# Altium schematic sheet Microcontroller.SchDoc
size D
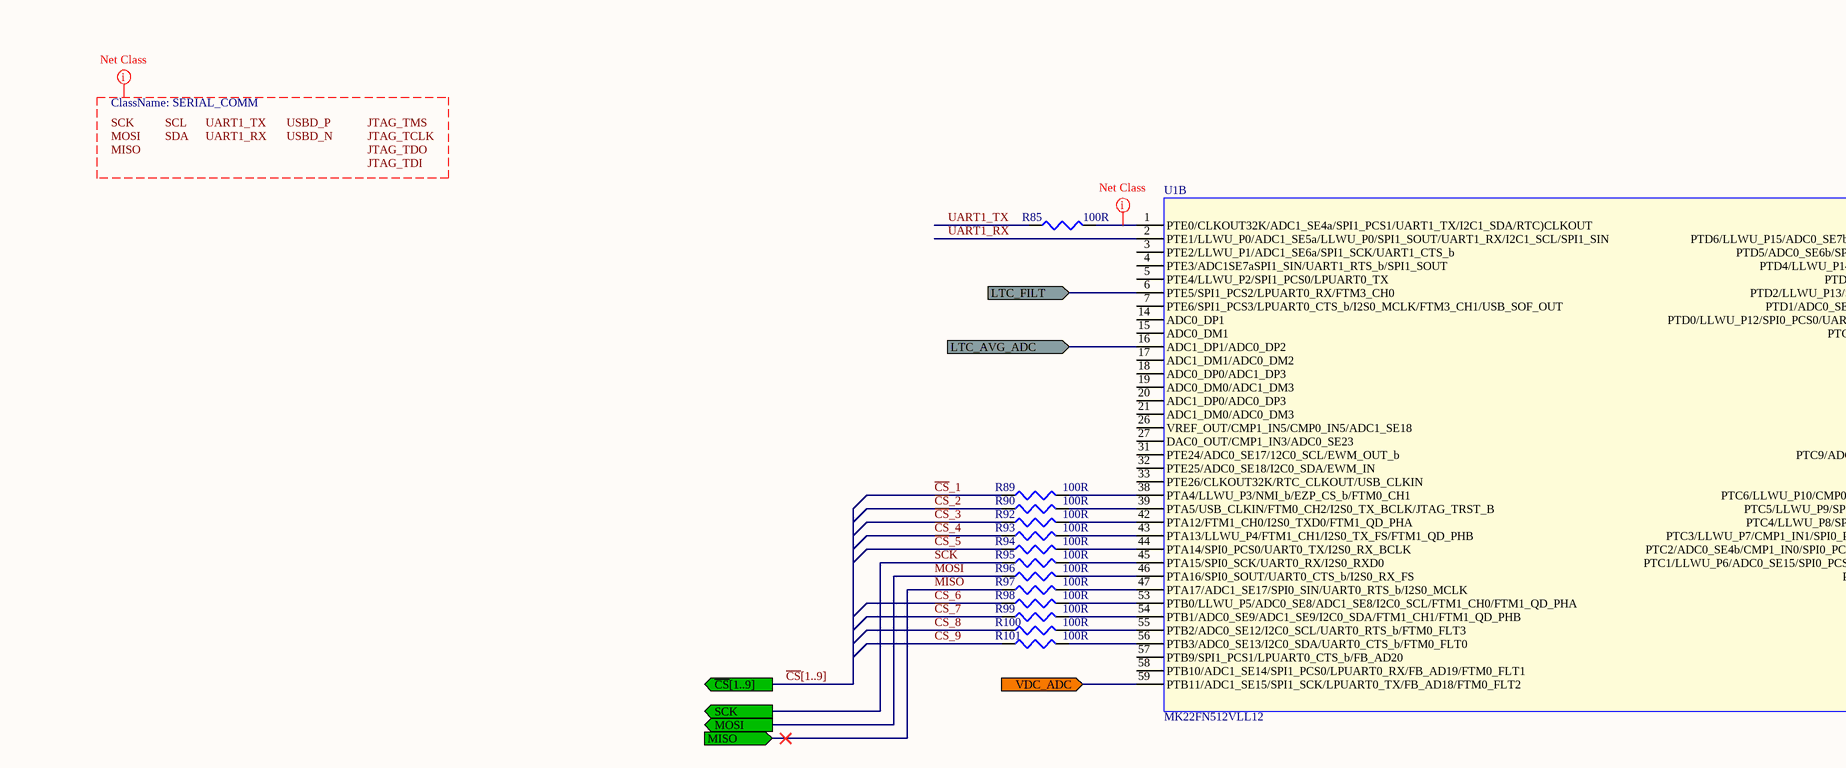
[diagram p0: Microcontroller.SchDoc, top left]
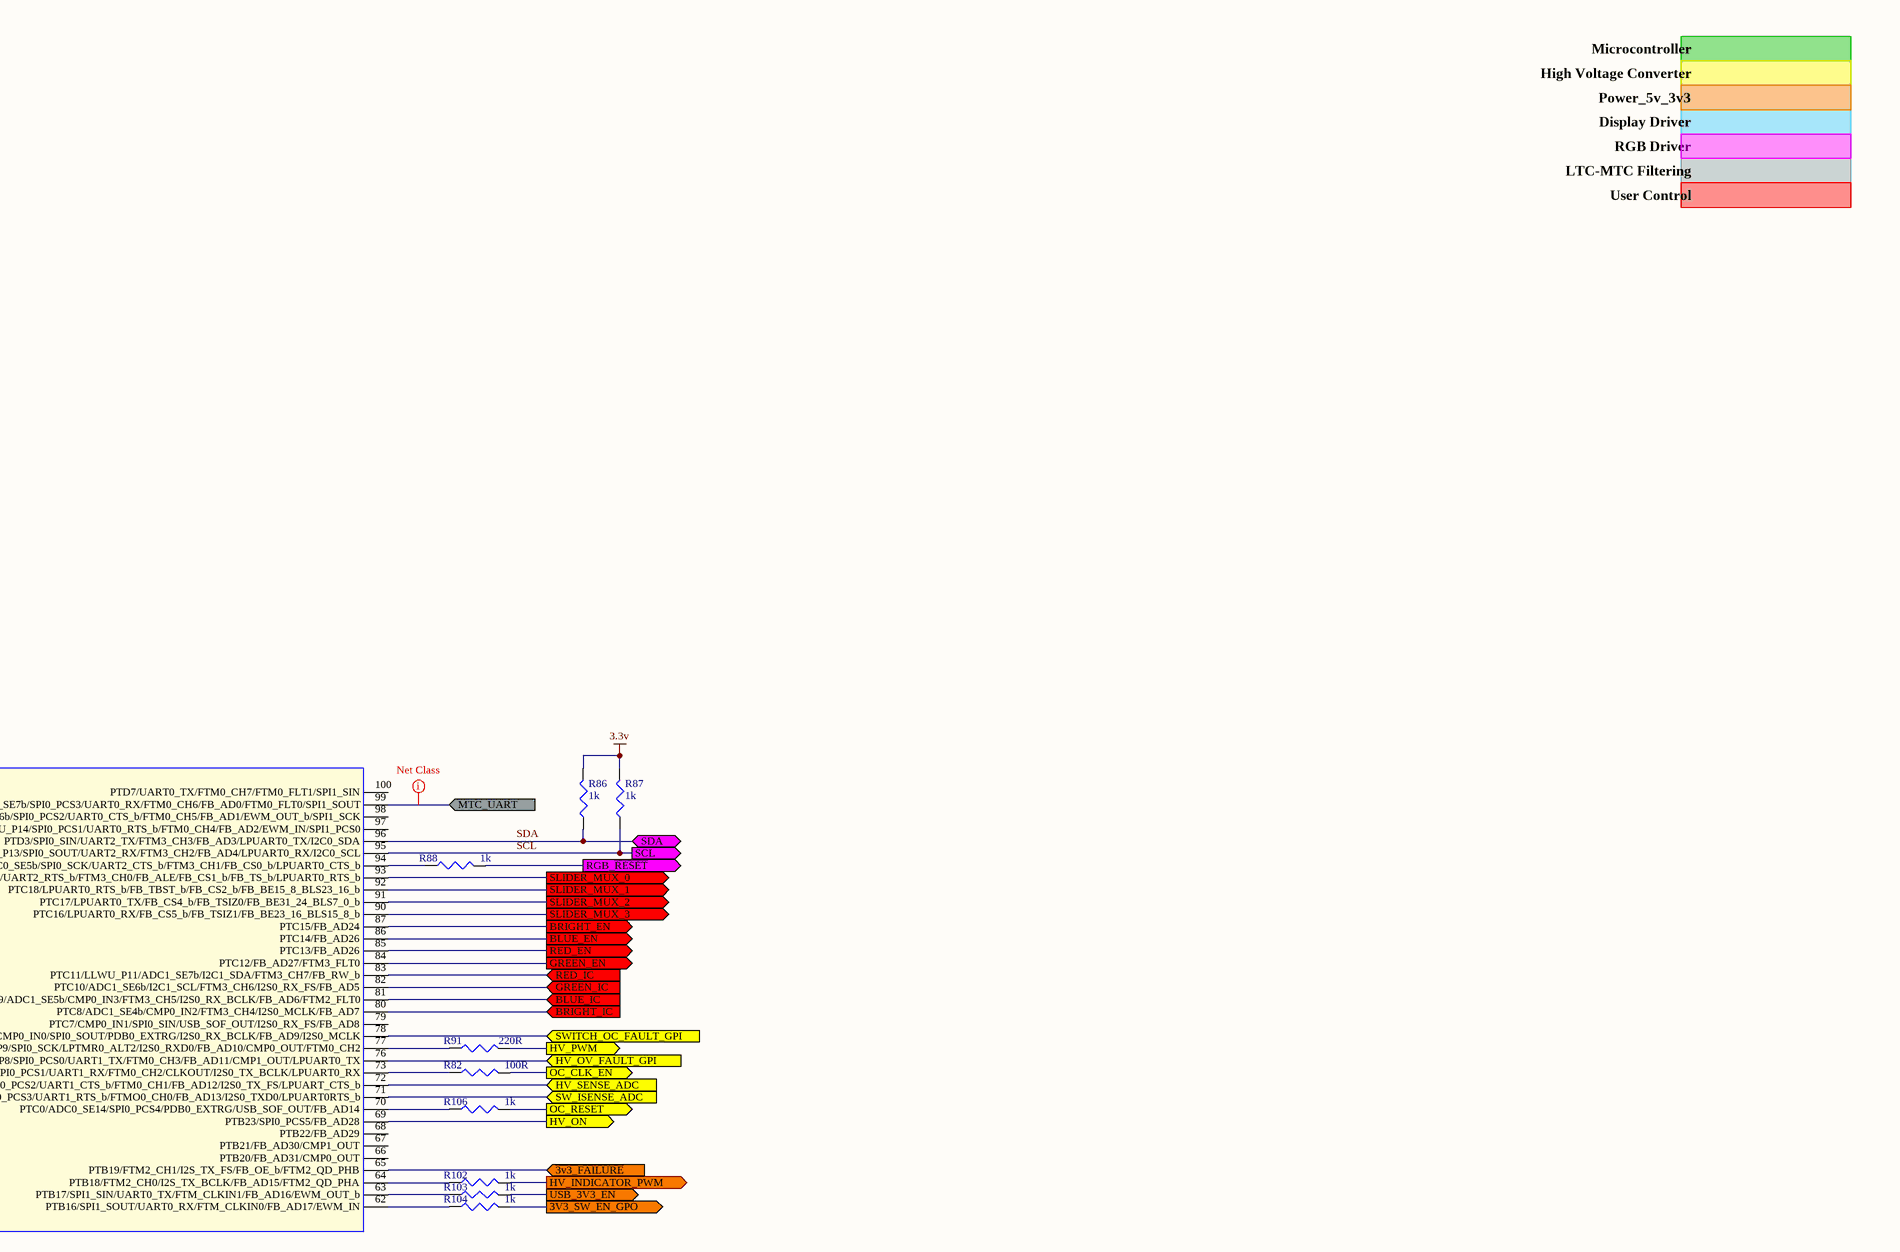
[diagram p1: Microcontroller.SchDoc, top right]
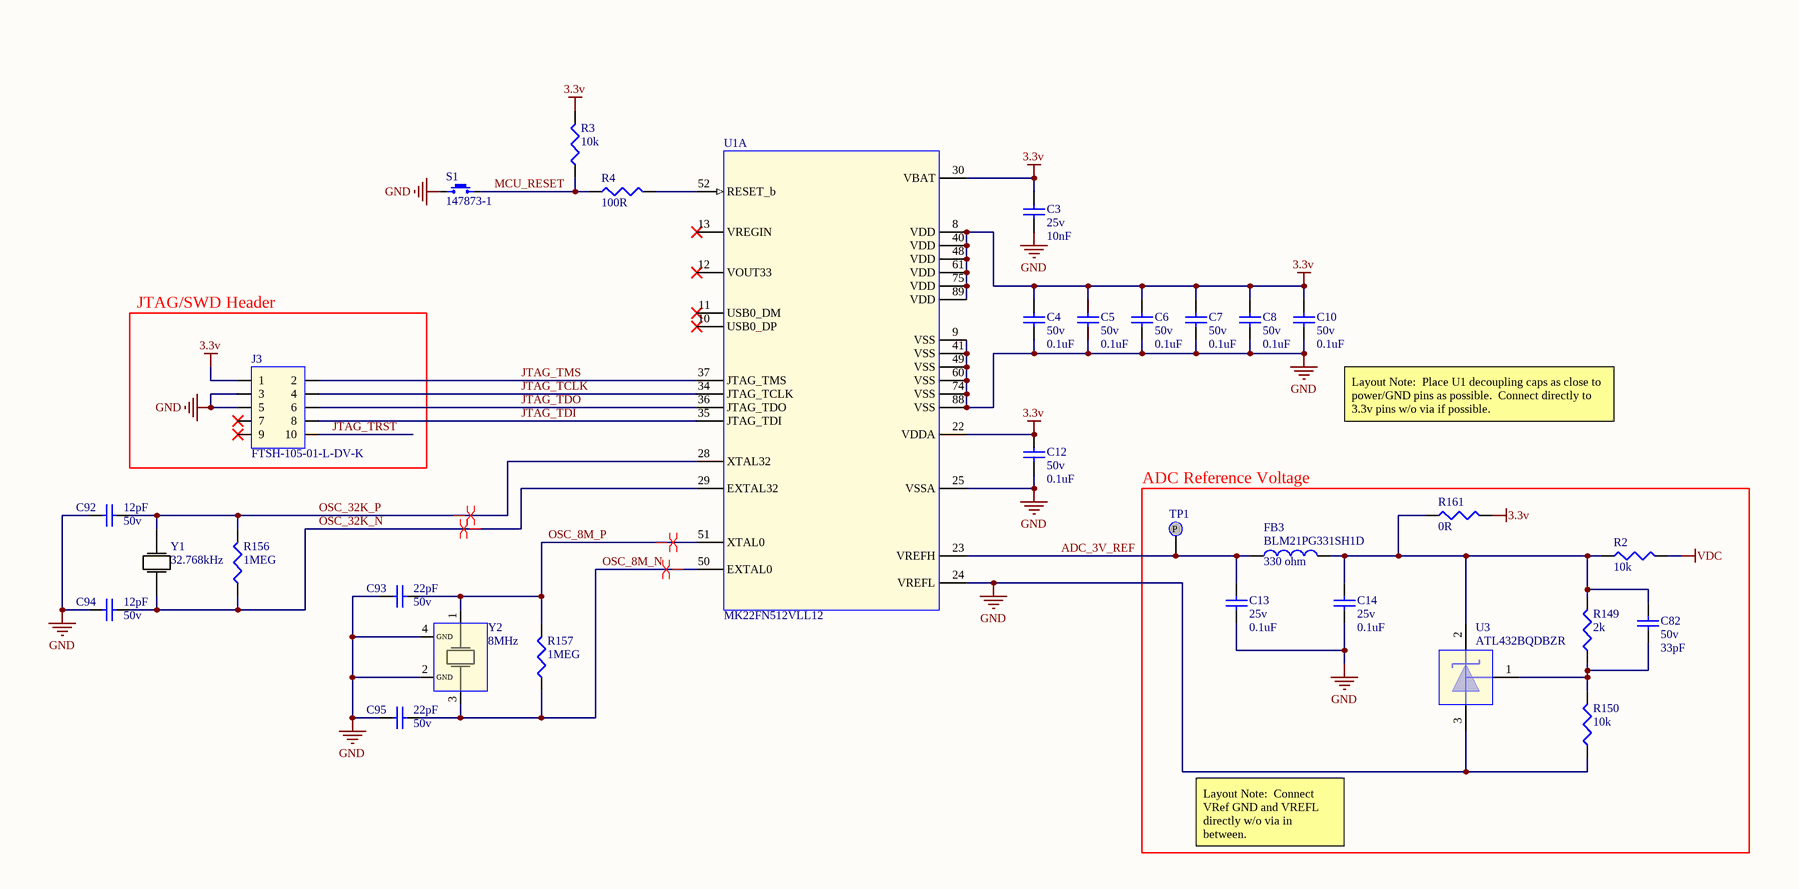
[diagram p2: Microcontroller.SchDoc, bottom left]
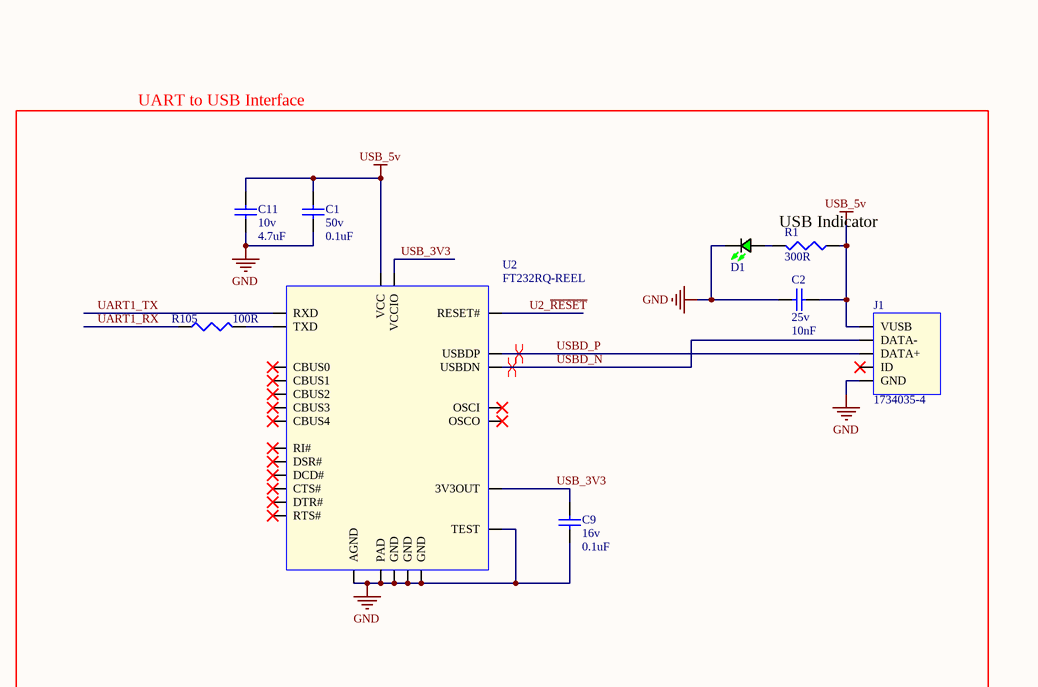
[diagram p3: Microcontroller.SchDoc, bottom right]

## Parts
C1  Voltage: 50v  [CAP0603R]  (hidden comment: 0.1uF)
C2  Voltage: 25v  [CAP0402R]  (hidden comment: 10nF)
C3  Voltage: 25v  [CAP0402R]  (hidden comment: 10nF)
C4  Voltage: 50v  [CAP0603R]  (hidden comment: 0.1uF)
C5  Voltage: 50v  [CAP0603R]  (hidden comment: 0.1uF)
C6  Voltage: 50v  [CAP0603R]  (hidden comment: 0.1uF)
C7  Voltage: 50v  [CAP0603R]  (hidden comment: 0.1uF)
C8  Voltage: 50v  [CAP0603R]  (hidden comment: 0.1uF)
C9  Voltage: 16v  [CAP0603R]  (hidden comment: 0.1uF)
C10  Voltage: 50v  [CAP0603R]  (hidden comment: 0.1uF)
C11  Voltage: 10v  [CAP0805R]  (hidden comment: 4.7uF)
C12  Voltage: 50v  [CAP0603R]  (hidden comment: 0.1uF)
C13  Voltage: 25v  [CAP0603R]  (hidden comment: 0.1uF)
C14  Voltage: 25v  [CAP0603R]  (hidden comment: 0.1uF)
C82  Voltage: 50v  [CAP0402R]  (hidden comment: 33pF)
C92  Voltage: 50v  [CAP0402R]  (hidden comment: 12pF)
C93  Voltage: 50v  [CAP0402R]  (hidden comment: 22pF)
C94  Voltage: 50v  [CAP0402R]  (hidden comment: 12pF)
C95  Voltage: 50v  [CAP0402R]  (hidden comment: 22pF)
D1  LTST-S270KGKT  [LED Green 0603]  (value not drawn)
FB3  BLM21PG331SH1D  IMPEDANCE: 330 ohm  [RES0805R]
J1  1734035-4  [USB MINI-B 1734035-4]
J3  FTSH-105-01-L-DV-K  [2x5 JTAG Header]
R1  300R  [RES0402R]
R2  10k  [RES0402R]
R3  10k  [RES0402R]
R4  100R  [RES0402R]
R82  100R  [RES0402R]
R85  100R  [RES0402R]
R86  1k  [RES0402R]
R87  1k  [RES0402R]
R88  1k  [RES0402R]
R89  100R  [RES0402R]
R90  100R  [RES0402R]
R91  220R  [RES0402R]
R92  100R  [RES0402R]
R93  100R  [RES0402R]
R94  100R  [RES0402R]
R95  100R  [RES0402R]
R96  100R  [RES0402R]
R97  100R  [RES0402R]
R98  100R  [RES0402R]
R99  100R  [RES0402R]
R100  100R  [RES0402R]
R101  100R  [RES0402R]
R102  1k  [RES0402R]
R103  1k  [RES0402R]
R104  1k  [RES0402R]
R105  100R  [RES0402R]
R106  1k  [RES0402R]
R149  2k  [RES0402R]
R150  10k  [RES0402R]
R156  1MEG  [RES0402R]
R157  1MEG  [RES0402R]
R161  0R  [RES0402R]
S1  147873-1  [TECONN_14783-1]
TP1  NONE  [TESTPOINT - 1.5mm Round Pad]  (value not drawn)
U1  MK22FN512VLL12  [LQFP100 0.5mm 14mmx14mm]  (parts A,B of 2)
U2  FT232RQ-REEL  [QFN32]
U3  ATL432BQDBZR  [SOT23-3M]
Y1  32.768kHz  [ABS07-32.768KHZ-T]
Y2  8MHz  [ABMM2-8.000MHZ-B2-T]

## Blocks framed on the sheet
JTAG/SWD Header: J3
ADC Reference Voltage: C13 C14 C82 FB3 R2 R149 R150 R161 TP1 U3

## Ports
3V3_SW_EN_GPO (out), BLUE_EN (out), BLUE_IC (in), BRIGHT_EN (out), BRIGHT_IC (in), GREEN_EN (out), GREEN_IC (in), HV_INDICATOR_PWM (out), HV_ON (out), HV_OV_FAULT_GPI (in), HV_PWM (out), HV_SENSE_ADC (in), LTC_AVG_ADC (in), LTC_FILT (in), MISO (in), MOSI (out), MTC_UART (in), OC_CLK_EN (out), OC_RESET (out), RED_EN (out), RED_IC (in), RGB_~{RESET} (out), SCK (out), SCL (out), SDA (bidir), SLIDER_MUX_0 (out), SLIDER_MUX_1 (out), SLIDER_MUX_2 (out), SLIDER_MUX_3 (out), SW_ISENSE_ADC (in), SWITCH_OC_FAULT_GPI (in), USB_3V3_EN (out), VDC_ADC (in), ~{3v3_FAILURE} (in), ~{CS}[1..9] (out)

## Nets
3.3v: C3.2 C4.1 C5.1 C6.1 C7.1 C8.1 C10.1 C12.1 J3.1 R3.2 R86.2 R87.2 R161.2 U1.8(VDD) U1.22(VDDA) U1.30(VBAT) U1.40(VDD) U1.48(VDD) U1.61(VDD) U1.75(VDD) U1.89(VDD)
GND: C1.2 C2.1 C3.1 C4.2 C5.2 C6.2 C7.2 C8.2 C9.1 C10.2 C11.2 C12.2 C13.2 C14.2 C92.2 C93.1 C94.2 C95.1 D1.1(K) J1.5(GND) J1.SH1 J1.SH2 J1.SH3 J1.SH4 J3.3 J3.5 R150.1 S1.1 U1.9(VSS) U1.24(VREFL) U1.25(VSSA) U1.41(VSS) U1.49(VSS) U1.60(VSS) U1.74(VSS) U1.88(VSS) U2.0(PAD) U2.4(GND) U2.17(GND) U2.20(GND) U2.24(AGND) U2.26(TEST) U3.3(A) Y2.2(GND) Y2.4(GND)
USB_5v: C1.1 C2.2 C11.1 J1.1(VUSB) R1.2 U2.19(VCC)
VDC: R2.2
~{3v3_FAILURE}: U1.65(PTB19/FTM2_CH1/I2S_TX_FS/FB_OE_b/FTM2_QD_PHB) ; port ~{3v3_FAILURE}
3V3_SW_EN_GPO: R104.2 ; port 3V3_SW_EN_GPO
ADC_3V_REF: C13.1 FB3.1 TP1.1 U1.23(VREFH)
BLUE_EN: U1.86(PTC14/FB_AD26) ; port BLUE_EN
BLUE_IC: U1.81(PTC9/ADC1_SE5b/CMP0_IN3/FTM3_CH5/I2S0_RX_BCLK/FB_AD6/FTM2_FLT0) ; port BLUE_IC
BRIGHT_EN: U1.87(PTC15/FB_AD24) ; port BRIGHT_EN
BRIGHT_IC: U1.80(PTC8/ADC1_SE4b/CMP0_IN2/FTM3_CH4/I2S0_MCLK/FB_AD7) ; port BRIGHT_IC
~{CS}_1: R89.1
~{CS}_2: R90.1
~{CS}_3: R92.1
~{CS}_4: R93.1
~{CS}_5: R94.1
~{CS}_6: R98.1
~{CS}_7: R99.1
~{CS}_8: R100.1
~{CS}_9: R101.1
GREEN_EN: U1.84(PTC12/FB_AD27/FTM3_FLT0) ; port GREEN_EN
GREEN_IC: U1.82(PTC10/ADC1_SE6b/I2C1_SCL/FTM3_CH6/I2S0_RX_FS/FB_AD5) ; port GREEN_IC
HV_INDICATOR_PWM: R102.2 ; port HV_INDICATOR_PWM
HV_ON: U1.69(PTB23/SPI0_PCS5/FB_AD28) ; port HV_ON
HV_OV_FAULT_GPI: U1.76(PTC4/LLWU_P8/SPI0_PCS0/UART1_TX/FTM0_CH3/FB_AD11/CMP1_OUT/LPUART0_TX) ; port HV_OV_FAULT_GPI
HV_PWM: R91.2 ; port HV_PWM
HV_SENSE_ADC: U1.72(PTC2/ADC0_SE4b/CMP1_IN0/SPI0_PCS2/UART1_CTS_b/FTM0_CH1/FB_AD12/I2S0_TX_FS/LPUART_CTS_b) ; port HV_SENSE_ADC
JTAG_TCLK: J3.4 U1.34(JTAG_TCLK)
JTAG_TDI: J3.8 U1.35(JTAG_TDI)
JTAG_TDO: J3.6 U1.36(JTAG_TDO)
JTAG_TMS: J3.2 U1.37(JTAG_TMS)
JTAG_TRST: J3.10
LTC_AVG_ADC: U1.16(ADC1_DP1/ADC0_DP2) ; port LTC_AVG_ADC
LTC_FILT: U1.6(PTE5/SPI1_PCS2/LPUART0_RX/FTM3_CH0) ; port LTC_FILT
MCU_RESET: R3.1 R4.1 S1.2
MISO: R97.1 ; port MISO
MOSI: R96.1 ; port MOSI
MTC_UART: U1.99(PTD6/LLWU_P15/ADC0_SE7b/SPI0_PCS3/UART0_RX/FTM0_CH6/FB_AD0/FTM0_FLT0/SPI1_SOUT) ; port MTC_UART
OC_CLK_EN: R82.2 ; port OC_CLK_EN
OC_RESET: R106.2 ; port OC_RESET
OSC_8M_N: C95.2 R157.1 U1.50(EXTAL0) Y2.3
OSC_8M_P: C93.2 R157.2 U1.51(XTAL0) Y2.1
OSC_32K_N: C94.1 R156.1 U1.29(EXTAL32) Y1.2
OSC_32K_P: C92.1 R156.2 U1.28(XTAL32) Y1.1
RED_EN: U1.85(PTC13/FB_AD26) ; port RED_EN
RED_IC: U1.83(PTC11/LLWU_P11/ADC1_SE7b/I2C1_SDA/FTM3_CH7/FB_RW_b) ; port RED_IC
RGB_~{RESET}: R88.2 ; port RGB_~{RESET}
SCK: R95.1 ; port SCK
SCL: R87.1 U1.95(PTD2/LLWU_P13/SPI0_SOUT/UART2_RX/FTM3_CH2/FB_AD4/LPUART0_RX/I2C0_SCL) ; port SCL
SDA: R86.1 U1.96(PTD3/SPI0_SIN/UART2_TX/FTM3_CH3/FB_AD3/LPUART0_TX/I2C0_SDA) ; port SDA
SLIDER_MUX_0: U1.93(PTD0/LLWU_P12/SPI0_PCS0/UART2_RTS_b/FTM3_CH0/FB_ALE/FB_CS1_b/FB_TS_b/LPUART0_RTS_b) ; port SLIDER_MUX_0
SLIDER_MUX_1: U1.92(PTC18/LPUART0_RTS_b/FB_TBST_b/FB_CS2_b/FB_BE15_8_BLS23_16_b) ; port SLIDER_MUX_1
SLIDER_MUX_2: U1.91(PTC17/LPUART0_TX/FB_CS4_b/FB_TSIZ0/FB_BE31_24_BLS7_0_b) ; port SLIDER_MUX_2
SLIDER_MUX_3: U1.90(PTC16/LPUART0_RX/FB_CS5_b/FB_TSIZ1/FB_BE23_16_BLS15_8_b) ; port SLIDER_MUX_3
SW_ISENSE_ADC: U1.71(PTC1/LLWU_P6/ADC0_SE15/SPI0_PCS3/UART1_RTS_b/FTMO0_CH0/FB_AD13/I2S0_TXD0/LPUART0RTS_b) ; port SW_ISENSE_ADC
SWITCH_OC_FAULT_GPI: U1.78(PTC6/LLWU_P10/CMP0_IN0/SPI0_SOUT/PDB0_EXTRG/I2S0_RX_BCLK/FB_AD9/I2S0_MCLK) ; port SWITCH_OC_FAULT_GPI
U2_~{RESET}: U2.18(RESET#)
UART1_RX: R105.1 U1.2(PTE1/LLWU_P0/ADC1_SE5a/LLWU_P0/SPI1_SOUT/UART1_RX/I2C1_SCL/SPI1_SIN)
UART1_TX: R85.1 U2.2(RXD)
USB_3V3: C9.2 U2.1(VCCIO) U2.16(3V3OUT)
USB_3V3_EN: R103.2 ; port USB_3V3_EN
USBD_N: J1.2(DATA-) U2.15(USBDN)
USBD_P: J1.3(DATA+) U2.14(USBDP)
VDC_ADC: U1.59(PTB11/ADC1_SE15/SPI1_SCK/LPUART0_TX/FB_AD18/FTM0_FLT2) ; port VDC_ADC
NetC14_1: C14.1 C82.1 FB3.2 R2.1 R149.2 R161.1 U3.2(K)
NetC82_2: C82.2 R149.1 R150.2 U3.1(REF)
NetD1_2: D1.2(A) R1.1
NetR4_2: R4.2 U1.52(RESET_b)
NetR82_1: R82.1 U1.73(PTC3/LLWU_P7/CMP1_IN1/SPI0_PCS1/UART1_RX/FTM0_CH2/CLKOUT/I2S0_TX_BCLK/LPUART0_RX)
NetR85_2: R85.2 U1.1(PTE0/CLKOUT32K/ADC1_SE4a/SPI1_PCS1/UART1_TX/I2C1_SDA/RTC)CLKOUT)
NetR88_1: R88.1 U1.94(PTD1/ADC0_SE5b/SPI0_SCK/UART2_CTS_b/FTM3_CH1/FB_CS0_b/LPUART0_CTS_b)
NetR89_2: R89.2 U1.38(PTA4/LLWU_P3/NMI_b/EZP_CS_b/FTM0_CH1)
NetR90_2: R90.2 U1.39(PTA5/USB_CLKIN/FTM0_CH2/I2S0_TX_BCLK/JTAG_TRST_B)
NetR91_1: R91.1 U1.77(PTC5/LLWU_P9/SPI0_SCK/LPTMR0_ALT2/I2S0_RXD0/FB_AD10/CMP0_OUT/FTM0_CH2)
NetR92_2: R92.2 U1.42(PTA12/FTM1_CH0/I2S0_TXD0/FTM1_QD_PHA)
NetR93_2: R93.2 U1.43(PTA13/LLWU_P4/FTM1_CH1/I2S0_TX_FS/FTM1_QD_PHB)
NetR94_2: R94.2 U1.44(PTA14/SPI0_PCS0/UART0_TX/I2S0_RX_BCLK)
NetR95_2: R95.2 U1.45(PTA15/SPI0_SCK/UART0_RX/I2S0_RXD0)
NetR96_2: R96.2 U1.46(PTA16/SPI0_SOUT/UART0_CTS_b/I2S0_RX_FS)
NetR97_2: R97.2 U1.47(PTA17/ADC1_SE17/SPI0_SIN/UART0_RTS_b/I2S0_MCLK)
NetR98_2: R98.2 U1.53(PTB0/LLWU_P5/ADC0_SE8/ADC1_SE8/I2C0_SCL/FTM1_CH0/FTM1_QD_PHA)
NetR99_2: R99.2 U1.54(PTB1/ADC0_SE9/ADC1_SE9/I2C0_SDA/FTM1_CH1/FTM1_QD_PHB)
NetR100_2: R100.2 U1.55(PTB2/ADC0_SE12/I2C0_SCL/UART0_RTS_b/FTM0_FLT3)
NetR101_2: R101.2 U1.56(PTB3/ADC0_SE13/I2C0_SDA/UART0_CTS_b/FTM0_FLT0)
NetR102_1: R102.1 U1.64(PTB18/FTM2_CH0/I2S_TX_BCLK/FB_AD15/FTM2_QD_PHA)
NetR103_1: R103.1 U1.63(PTB17/SPI1_SIN/UART0_TX/FTM_CLKIN1/FB_AD16/EWM_OUT_b)
NetR104_1: R104.1 U1.62(PTB16/SPI1_SOUT/UART0_RX/FTM_CLKIN0/FB_AD17/EWM_IN)
NetR105_2: R105.2 U2.30(TXD)
NetR106_1: R106.1 U1.70(PTC0/ADC0_SE14/SPI0_PCS4/PDB0_EXTRG/USB_SOF_OUT/FB_AD14)

Not connected (* = marked no-connect by the designer): J1 4(ID)*; J3 7* 9*; U1 3(PTE2/LLWU_P1/ADC1_SE6a/SPI1_SCK/UART1_CTS_b) 4(PTE3/ADC1SE7aSPI1_SIN/UART1_RTS_b/SPI1_SOUT) 5(PTE4/LLWU_P2/SPI1_PCS0/LPUART0_TX) 7(PTE6/SPI1_PCS3/LPUART0_CTS_b/I2S0_MCLK/FTM3_CH1/USB_SOF_OUT) 10(USB0_DP)* 11(USB0_DM)* 12(VOUT33)* 13(VREGIN)* 14(ADC0_DP1) 15(ADC0_DM1) 17(ADC1_DM1/ADC0_DM2) 18(ADC0_DP0/ADC1_DP3) 19(ADC0_DM0/ADC1_DM3) 20(ADC1_DP0/ADC0_DP3) 21(ADC1_DM0/ADC0_DM3) 26(VREF_OUT/CMP1_IN5/CMP0_IN5/ADC1_SE18) 27(DAC0_OUT/CMP1_IN3/ADC0_SE23) 31(PTE24/ADC0_SE17/12C0_SCL/EWM_OUT_b) 32(PTE25/ADC0_SE18/I2C0_SDA/EWM_IN) 33(PTE26/CLKOUT32K/RTC_CLKOUT/USB_CLKIN) 57(PTB9/SPI1_PCS1/LPUART0_CTS_b/FB_AD20) 58(PTB10/ADC1_SE14/SPI1_PCS0/LPUART0_RX/FB_AD19/FTM0_FLT1) 66(PTB20/FB_AD31/CMP0_OUT) 67(PTB21/FB_AD30/CMP1_OUT) 68(PTB22/FB_AD29) 79(PTC7/CMP0_IN1/SPI0_SIN/USB_SOF_OUT/I2S0_RX_FS/FB_AD8) 97(PTD4/LLWU_P14/SPI0_PCS1/UART0_RTS_b/FTM0_CH4/FB_AD2/EWM_IN/SPI1_PCS0) 98(PTD5/ADC0_SE6b/SPI0_PCS2/UART0_CTS_b/FTM0_CH5/FB_AD1/EWM_OUT_b/SPI1_SCK) 100(PTD7/UART0_TX/FTM0_CH7/FTM0_FLT1/SPI1_SIN); U2 3(RI#)* 5(NC) 6(DSR#)* 7(DCD#)* 8(CTS#)* 9(CBUS4)* 10(CBUS2)* 11(CBUS3)* 12(NC) 13(NC) 21(CBUS1)* 22(CBUS0)* 23(NC) 25(NC) 27(OSCI)* 28(OSCO)* 29(NC) 31(DTR#)* 32(RTS#)*

## Buses and harness runs
bus ~{CS}[1..9] = port ~{CS}[1..9]

## Layout directives
differential pair: OSC_8M_N, OSC_8M_P, OSC_32K_N, OSC_32K_P, USBD_N, USBD_P
net class SERIAL_COMM: JTAG_TCLK, JTAG_TDI, JTAG_TDO, JTAG_TMS, MISO, MOSI, MTC_UART, NetR85_2, SCK, SCL, SDA, UART1_RX, UART1_TX, USBD_N, USBD_P

## Notes on the sheet
- Microcontroller
- High Voltage Converter
- Display Driver
- Power_5v_3v3
- RGB Driver
- LTC-MTC Filtering
- User Control
- UART to USB Interface
- USB Indicator
- Layout Note:  Place U1 decoupling caps as close to power/GND pins as possible.  Connect directly to 3.3v pins w/o via if possible.
- Layout Note:  Connect VRef GND and VREFL directly w/o via in between.
- Labels drawn without touching a wire or pin: JTAG_TCLK, JTAG_TDI, JTAG_TDO, JTAG_TMS, MISO, MOSI, SCK, SCL, SDA, UART1_RX, UART1_TX, USBD_N, USBD_P
- (in symbol Testpoint 1.5mm Pad) P

## Library data of the parts
C1 C4-C8 C10 C12 = 0.1uF 50v (0603): MFG_PN: VJ0603V104ZXAPW1BC; MFG: Vishay; LOAD: NL; Value: 0.1uF
C2 C3 = 10nF 25v (0402): Tolerance: 5%; MFG_PN: VJ0402Y103JXXAC; MFG: Vishay; LOAD: NL; Value: 10nF
C9 = 0.1uF 16v (0603): MFG_PN: VJ0603Y104JXJPW1BC; MFG: Vishay; LOAD: NL; Value: 0.1uF
C11 = 4.7uF 10v (0805): MFG_PN: VJ0805V475MXQTW1BC; MFG: Vishay; LOAD: NL; Value: 4.7uF
C13 C14 = 0.1uF 25v (0603): MFG_PN: VJ0603Y104KXXCW1BC; MFG: Vishay; LOAD: NL; TEMP_MAX: 125C; Value: 0.1uF
C82 = 33pF 50v (0402): Tolerance: 5%; MFG_PN: VJ0402A330JXACW1BC; MFG: Vishay; LOAD: NL; Value: 33pF
C92 C94 = 12pF 50v (0402): Tolerance: 5%; MFG_PN: GRM1555C1H120JA01D; MFG: Murata; LOAD: NL; Value: 12pF
C93 C95 = 22pF 50v (0402): Tolerance: 5%; MFG_PN: 04025A220JAT2A; MFG: AVX; LOAD: NL; Value: 22pF
D1 = LED Green 0603: MFG: Lite On; VFORWARD: 2v; CURRENT: 20mA; COLOR: Green; MFG_PN: LTST-S270KGKT
FB3 = BLM21PG331SH1D (0805): MFG: MURATA; CURRENT: 3A; LOAD: NL; TOLERANCE: 20%; MFG_PN: BLM21PG331SH1D
J1 = USB Mini-B Female: USB Mini B Female; MFG: TE CONNECTIVITY; CONTACTS: 5; LOAD: NL; MFG_PN: 1734035-4; TYPE: USB Mini B; GENDER: FEMALE
J3 = 2x5 JTAG Header SMD Shrouded: 2x5 JTAG Header SMD Shrouded (1.27mm); LOAD: NL; MFG: SAMTEC; CURRENT: 1A; MFG_PN: FTSH-105-01-L-DV-K
R1 = 300R (0402): Tolerance: 1%; POWER: 63mW; MFG_PN: CRCW0402300RFKED; MFG: Vishay; Load: NL; Value: 300R
R2 R3 R150 = 10k (0402): Tolerance: 1%; POWER: 63mW; MFG_PN: CRCW040210K0FKED; MFG: Vishay; Load: NL; Value: 10k
R4 R82 R85 R89 R90 R92-R101 R105 = 100R (0402): Tolerance: 1%; POWER: 63mW; MFG_PN: CRCW0402100RFKED; MFG: Vishay; Load: NL; Value: 100R
R86-R88 R102-R104 R106 = 1k (0402): Tolerance: 1%; POWER: 63mW; MFG_PN: CRCW04021K00FKED; MFG: Vishay; Load: NL; Value: 1k
R91 = 220R (0402): Tolerance: 1%; POWER: 63mW; MFG_PN: CRCW0402220RFKED; MFG: Vishay; Load: NL; Value: 220R
R149 = 2k (0402): Tolerance: 1%; POWER: 63mW; MFG_PN: CRCW04022K00FKED; MFG: Vishay; Load: NL; Value: 2k
R156 R157 = 1MEG (0402): Tolerance: 1%; POWER: 63mW; MFG_PN: CRCW04021M00FKED; MFG: Vishay; Load: NL; Value: 1MEG
R161 = 0R (0402): MFG_PN: CRCW04020000Z0ED; MFG: Vishay; Load: NL; Value: 0R
S1 = SPST Momentary Micro: Micro SPST Momentary Switch; MFG: TE CONNECTIVITY; LOAD: NL; CURRENT: 50mA; VOLTAGE: 24v; MFG_PN: 147873-1
TP1 = Testpoint 1.5mm Pad: 1.5mm Testpoint
U1 = MK22FN512VLL12: 32-bit ARM Cortex-M4 Microcontroller; MFG: FREESCALE; MFG_PN: MK22FN512VLL12
U2 = FT232RQ-REEL: UART Interface/Bridge; MFG: FTDI; MFG_PN: FT232RQ-REEL
U3 = ATL432BQDBZR: Shunt Voltage Reference, 0.5%; MFG: TI; VREF: 2.500v; MFG_PN: ATL432BQDBZR
Y1 = 32kHz Crystal: MFG: ABRACON; CLOAD: 12.5pF; FREQ: 32.768kHz; MFG_PN: ABS07-32.768KHZ-T
Y2 = 8.0MHz Crystal 18pF 20ppm: 8.0MHz Crystal; MFG: ABRACON; CLOAD: 18pF; MFG_PN: ABM3B-8.000MHZ-B2-T; FREQ: 8MHz